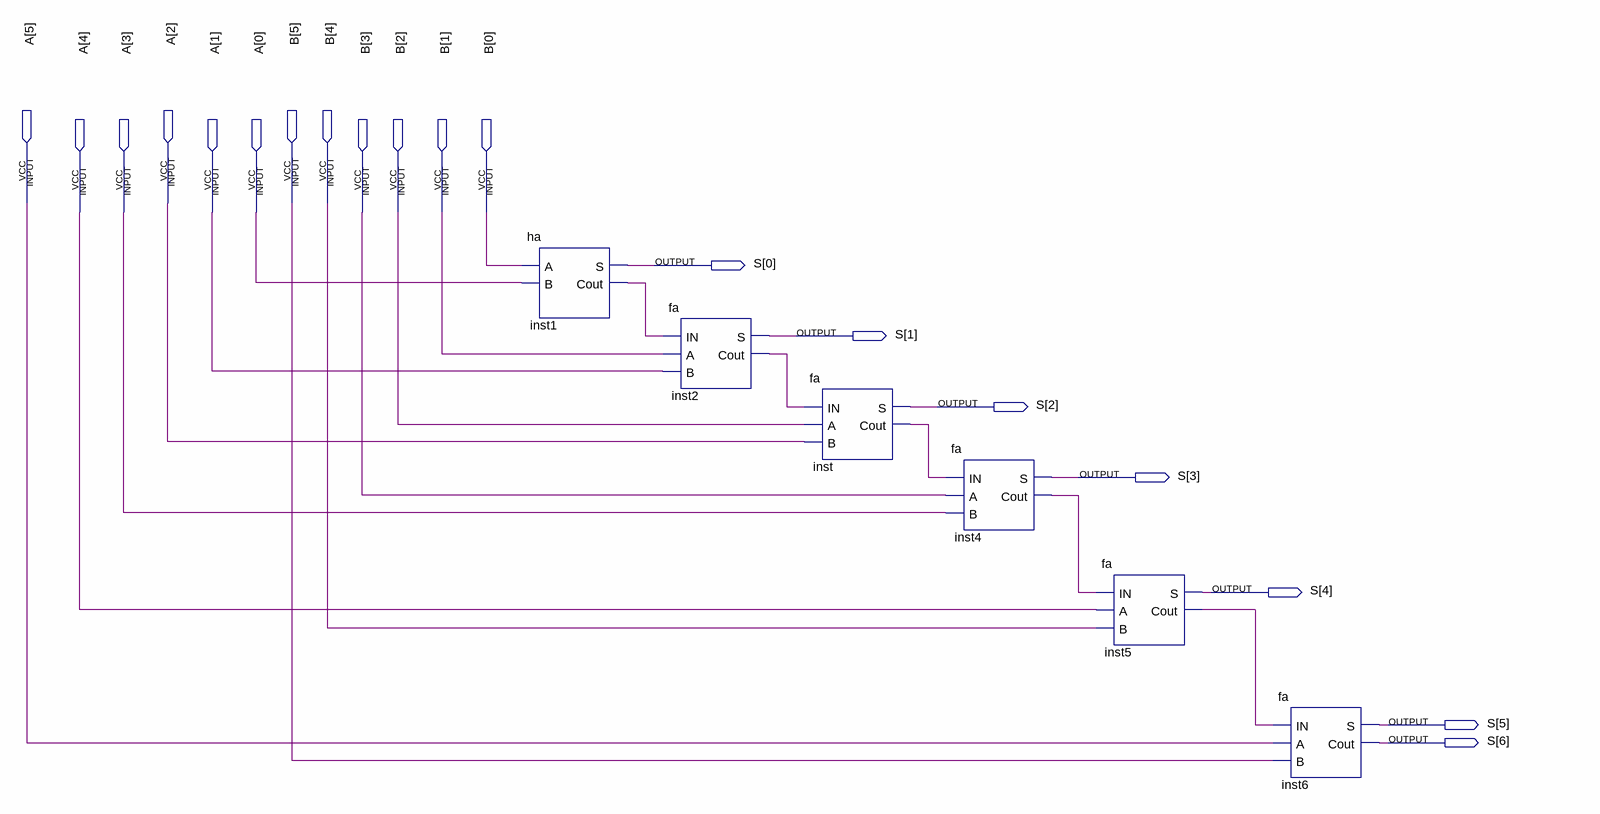
[diagram p0: schematic sheet]
// Quartus schematic somador_6bits.bdf as structural Verilog: 6 symbols, 19 pins
module somador_6bits (
  input  [5:0] A,
  input  [5:0] B,
  output [6:0] S
);

  wire inst1_cout, inst2_cout, inst4_cout, inst5_cout, inst_cout;

  ha inst1 (.A(B[0]), .B(A[0]), .S(S[0]), .Cout(inst1_cout));
  fa inst2 (.IN(inst1_cout), .A(B[1]), .B(A[1]), .S(S[1]), .Cout(inst2_cout));
  fa inst (.IN(inst2_cout), .A(B[2]), .B(A[2]), .S(S[2]), .Cout(inst_cout));
  fa inst4 (.IN(inst_cout), .A(B[3]), .B(A[3]), .S(S[3]), .Cout(inst4_cout));
  fa inst5 (.IN(inst4_cout), .A(A[4]), .B(B[4]), .S(S[4]), .Cout(inst5_cout));
  fa inst6 (.IN(inst5_cout), .A(A[5]), .B(B[5]), .S(S[5]), .Cout(S[6]));
endmodule
